# Altium schematic sheet DIMM Module Tester.SchDoc
size A3
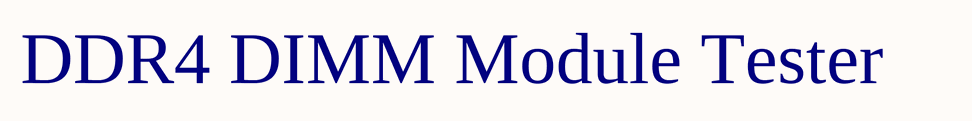
[diagram p0: DIMM Module Tester.SchDoc]

## Notes on the sheet
- DDR4 DIMM Module Tester